# EAGLE design musicbox-interface (EAGLE 7.2.0)
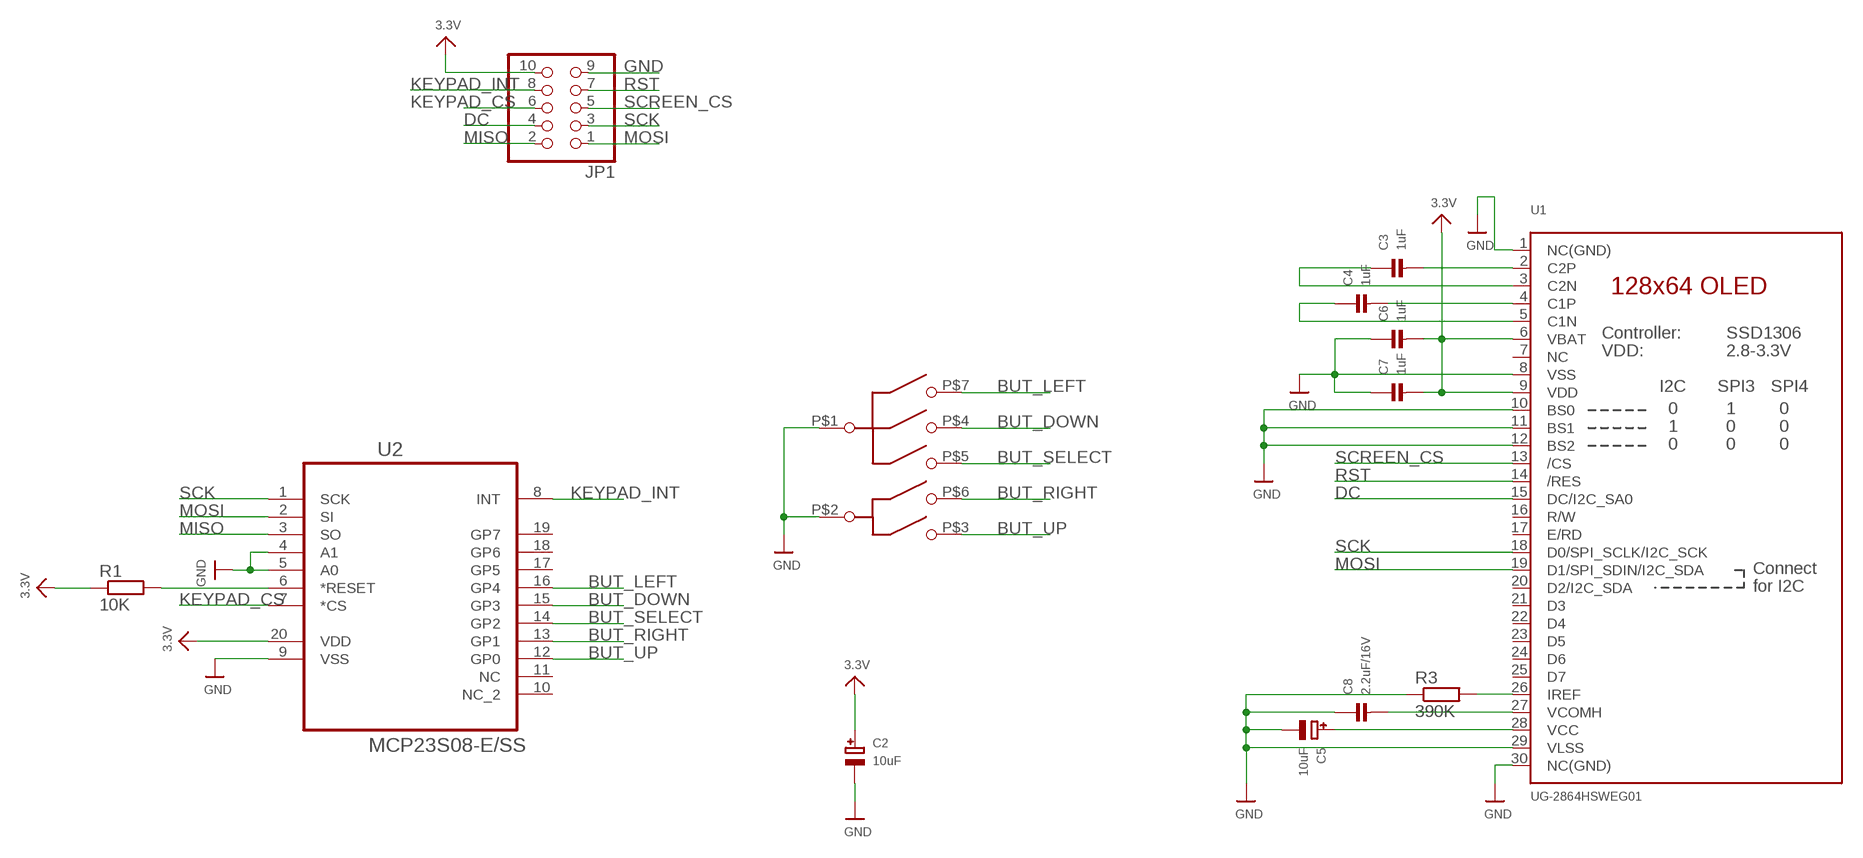
[diagram p0: schematic, sheet 1]

## Parts
C2  10uF  CAP_TANTALUMA/3216_REFLOW  [EIA3216-18/A-R]
C3  1uF  CAP_CERAMIC0603  [0603]
C4  1uF  CAP_CERAMIC0603  [0603]
C5  10uF  CAP_TANTALUMA/3216_REFLOW  [EIA3216-18/A-R]
C6  1uF  CAP_CERAMIC0603  [0603]
C7  1uF  CAP_CERAMIC0603  [0603]
C8  2.2uF/16V  CAP_CERAMIC0603  [0603]
JP1  HEADER-2X5  [2X05]
R1  10K  R-EU_R0603  [R0603]
R3  390K  R-EU_R0603  [R0603]
U1  UG-2864HSWEG01  DISP_OLED_UG-2864HSWEG010.96"  [UG-2864HSWEG01_0.96IN_WRAPAROUND]
U2  MCP23S08-E/SS  [SOP65P780X200-20N]
U$5  TPA  [SMT]

## Nets
3.3V: C2.+ C6.2 C7.2 JP1.10 R1.1 U1.6(VBAT) U1.9(VDD) U2.20(VDD)
BUT_DOWN: U2.15(GP3) U$5.P$4(DOWN)
BUT_LEFT: U2.16(GP4) U$5.P$7(LEFT)
BUT_RIGHT: U2.13(GP1) U$5.P$6(RIGHT)
BUT_SELECT: U2.14(GP2) U$5.P$5(SELECT)
BUT_UP: U2.12(GP0) U$5.P$3(UP)
DC: JP1.4 U1.15(DC/I2C_SA0)
GND: C2.- C5.- C6.1 C7.1 C8.1 JP1.9 R3.1 U1.1(NC(GND)) U1.8(VSS) U1.10(BS0) U1.11(BS1) U1.12(BS2) U1.29(VLSS) U1.30(NC(GND)) U2.4(A1) U2.5(A0) U2.9(VSS) U$5.P$1(COMMON_1) U$5.P$2(COMMON_2)
KEYPAD_CS: JP1.6 U2.7(*CS)
KEYPAD_INT: JP1.8 U2.8(INT)
MISO: JP1.2 U2.3(SO)
MOSI: JP1.1 U1.19(D1/SPI_SDIN/I2C_SDA) U2.2(SI)
N$1: C5.+ U1.28(VCC)
N$2: R1.2 U2.6(*RESET)
N$3: R3.2 U1.26(IREF)
N$4: C3.2 U1.2(C2P)
N$5: C3.1 U1.3(C2N)
N$6: C4.2 U1.4(C1P)
N$7: C4.1 U1.5(C1N)
N$12: C8.2 U1.27(VCOMH)
RST: JP1.7 U1.14(/RES)
SCK: JP1.3 U1.18(D0/SPI_SCLK/I2C_SCK) U2.1(SCK)
SCREEN_CS: JP1.5 U1.13(/CS)
Unconnected: U1.7(NC) U1.16(R/W) U1.17(E/RD) U1.20(D2/I2C_SDA) U1.21(D3) U1.22(D4) U1.23(D5) U1.24(D6) U1.25(D7) U2.10(NC_2) U2.11(NC) U2.17(GP5) U2.18(GP6) U2.19(GP7)

## Library data of the parts
C2 C5 = microbuilder:CAP_TANTALUM: Tantalum Capacitors Wave footprints have larger pads and are meant to be used for hand soldering. Reflow footprints are optimised for solder paste and a reflow oven. EIA3216-18/A-[R/W] - Size A / 3216-18 / 1206 footprint 4.7µF 25V 10% Tantalum Capacitor 10µF 16V 10% Tantalum Capacitor [Digikey: 495-2236-2-ND] EIA3528-21/B-[R/W] - Size B / 3528-21 47µF 10V 10% Tantalum Capactior [Digikey: 495-2216-1-ND] EIA6032-28/C-[R/W] - Size C / 6032-28 10µF 35V 20% Tantalum Capacitor [Digikey: 495-2285-1-ND] 100µF 16V 10% Tantalum Capactior [Digikey: 399-5214-1-ND]
C3 C4 C6-C8 = microbuilder:CAP_CERAMIC: Ceramic Capacitors 0402 - 0402 Surface Mount Capacitors 16pF 50V 5% [Digikey: 445-4899-2-ND] 18pF 50V 5% [Digikey: 490-1281-2-ND] 22pF 50V 5% [Digikey: 490-1283-2-ND] 68pF 50V 5% [Digikey: 490-1289-2-ND] 0.1uF 10V 10% [Digikey: 490-1318-2-ND] 1.0uF 6.3V 10% [Digikey: 490-1320-2-ND] 0603 - 0603 Surface Mount Capacitors 16 pF 50V 5% [Digikey: 445-5051-2-ND] 22 pF 50V [Digikey: PCC220ACVTR-ND] 33 pF 50V 5% [Digikey: 490-1415-1-ND] 56pF 50V 5% [Digikey: 490-1421-1-ND] 220pF 50V 5% [Digikey: 445-1285-1-ND] 680 pF 50V 2200 pF 50V 5% C0G [Digikey: 445-1297-1-ND] 5600 pF 100V 5% X7R [Digikey: 478-3711-1-ND] 0.1 µF 25V 10% [Digikey: PCC2277TR-ND] 0.22 µF 16V 10% X7R [Digikey: 445-1318-1-ND] 1.0 µF 25V 10% [Digikey: 445-5146-2-ND] 0603 - RF Specific 3pF 250V +/-0.1pF RF [Digikey: 712-1347-1-ND] 18 pF 250V 5% [Digikey: 478-3505-1-ND or 712-1322-1-ND] 56 pF 250V 5% C0G RF [Digikey: 490-4867-1-ND] 68 pF 250V RF [Digikey: 490-4868-1-ND] 0805 - 0805 Surface Mount Capacitors 220 pF 250V 2% RF Ceramic Capacitor [Digikey: 712-1398-1-ND] 1000 pF 50V 2% NP0 Ceramic Capacitor [Digikey: 478-3760-1-ND] 0.1 µF 25V 10% Ceramic Capacitor [Digikey: PCC1828TR-ND] 1.0 µF 16V 10% Ceramic Capacitor[Digikey: 490-1691-2-ND] 10.0 µF 10V 10% Ceramic Capacitor[Digikey: 709-1228-1-ND] 10.0 uF 16V 10% Ceramic Capacitor [Digikey: 478-5165-2-ND] 47 uF 6.3V 20% Ceramic Capacitor [Digikey: 587-1779-1-ND or 399-5506-1-ND] 1206 - 1206 Surface Mount Capacitors 47uF 10V 20% Ceramic Capacitor [Digikey: 490-5528-1-ND or 399-5508-1-ND or 445-6010-1-ND] 100uF 6.3V -20%, +80% Y5V Ceramic Capacitor (Digikey: 490-4512-1-ND, Mouser: 81-GRM31CF50J107ZE1L)
JP1 = header2x5:HEADER-2X5: PIN HEADER
R1 R3 = rcl:R-EU_: RESISTOR, European symbol
U1 = microbuilder:DISP_OLED_UG-2864HSWEG01: UG-2864HSWEG01 OLED display Both 1.3" and 0.96" models share the same FPC tab footprint, only the screen dimensions vary.
U2 = Microchip_By_element14_Batch_1:MCP23S08-E/SS: 8BIT I/O EXPANDER, SPI, SMD; MPN: MCP23S08-E/SS; OC_FARNELL: 1292236; OC_NEWARK: 08J8734; PACKAGE: 20SSOP; SUPPLIER: Microchip
U$5 = ck_tpa:TPA

## Board
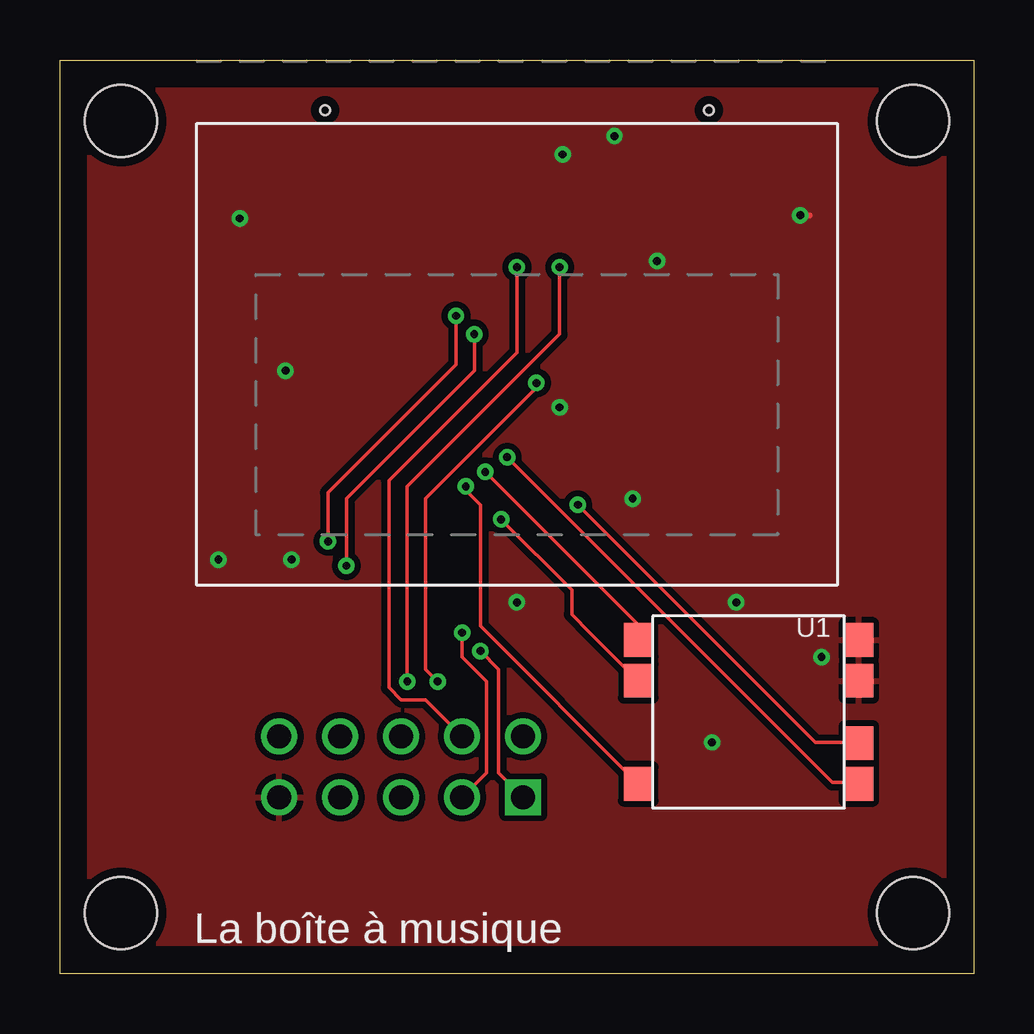
[diagram p1: board, top side]
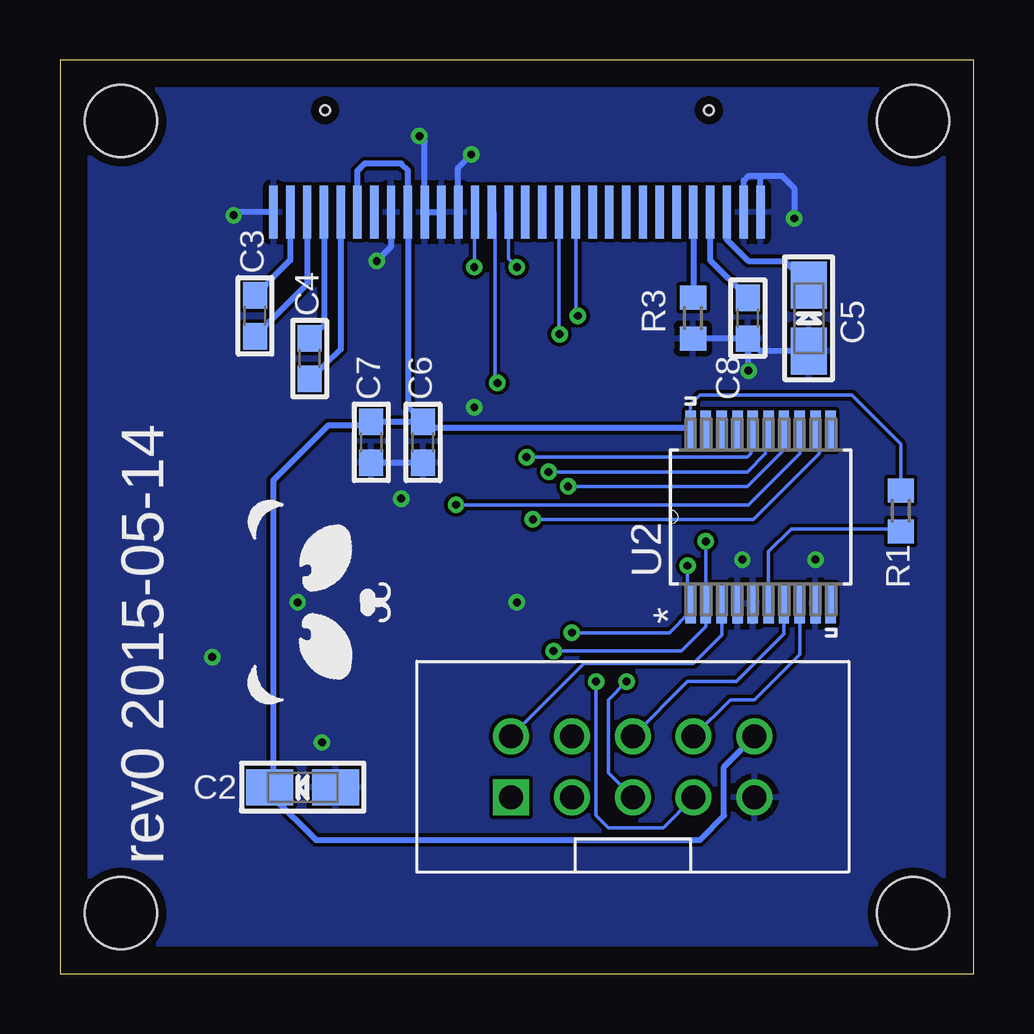
[diagram p2: board, bottom side, seen from below]

Size 38.1 x 38.1 mm. Coordinates in mm from the lower left corner, seen from the top.
Outline: 0,0 0,38.1 38.1,38.1 38.1,0 0,0
Copper layers (1*16): Top 0.0356mm / dielectric 1.5011mm / Bottom 0.0356mm
Design rules "LaenPCBOrder": minimum track width 6mil, minimum drill 13mil, track to track 6mil, track to pad 6mil, pad to pad 6mil, via to via 6mil, smd to smd 6mil, copper to edge 15mil, drill to drill 6mil, minimum pad ring 7mil, minimum via ring 7mil, stop-mask expansion 3mil, vias tented up to drill 0mil, thermal gap 10mil
Holes 3 mm at 2.54,35.56 35.56,35.56 2.54,2.54 35.56,2.54

### Footprints (pad centres in the part's own frame; a part is rotated, then mirrored left to right if it is on the bottom)
EIA3216-18/A-R = smd 1.95 x 1.5: + 1.375,0; - -1.375,0
0603 = smd 1.1 x 1: 1 -0.85,0; 2 0.85,0
2X05 = drill 1 square: 1 -5.08,-1.27 | drill 1: 2 -5.08,1.27; 3 -2.54,-1.27; 4 -2.54,1.27; 5 0,-1.27; 6 0,1.27; 7 2.54,-1.27; 8 2.54,1.27; 9 5.08,-1.27; 10 5.08,1.27
R0603 = smd 1 x 1.1: 1 -0.85,0; 2 0.85,0
UG-2864HSWEG01_0.96IN_WRAPAROUND = smd 0.35 x 2.2 bottom: 1 -10.15,-1.2; 2 -9.45,-1.2; 3 -8.75,-1.2; 4 -8.05,-1.2; 5 -7.35,-1.2; 6 -6.65,-1.2; 7 -5.95,-1.2; 8 -5.25,-1.2; 9 -4.55,-1.2; 10 -3.85,-1.2; 11 -3.15,-1.2; 12 -2.45,-1.2; 13 -1.75,-1.2; 14 -1.05,-1.2; 15 -0.35,-1.2; 16 0.35,-1.2; 17 1.05,-1.2; 18 1.75,-1.2; 19 2.45,-1.2; 20 3.15,-1.2; 21 3.85,-1.2; 22 4.55,-1.2; 23 5.25,-1.2; 24 5.95,-1.2; 25 6.65,-1.2; 26 7.35,-1.2; 27 8.05,-1.2; 28 8.75,-1.2; 29 9.45,-1.2; 30 10.15,-1.2 | hole 0.4: -8,-5.45; 8,-5.45
SOP65P780X200-20N = smd 1.676 x 0.432: 1 -3.607,2.921; 2 -3.607,2.286; 3 -3.607,1.626; 4 -3.607,0.965; 5 -3.607,0.33; 6 -3.607,-0.33; 7 -3.607,-0.965; 8 -3.607,-1.626; 9 -3.607,-2.286; 10 -3.607,-2.921; 11 3.607,-2.921; 12 3.607,-2.286; 13 3.607,-1.626; 14 3.607,-0.965; 15 3.607,-0.33; 16 3.607,0.33; 17 3.607,0.965; 18 3.607,1.626; 19 3.607,2.286; 20 3.607,2.921
SMT = smd 1.2 x 1.4: P$1 -4.6,-3; P$2 -4.6,-1.3; P$3 4.6,-1.3; P$4 4.6,-3; P$5 4.6,3; P$6 -4.6,1.3; P$7 -4.6,3

### Placement (x,y rotation side)
C2  27.98,7.78 180 bottom
C3  29.97,27.43 90 bottom
C4  27.69,25.65 90 bottom
C5  6.88,27.34 90 bottom
C6  22.96,22.16 90 bottom
C7  25.12,22.16 90 bottom
C8  9.42,27.34 90 bottom
JP1  14.22,8.64 0 bottom
R1  3.05,19.3 270 bottom
R3  11.71,27.34 90 bottom
U1  19.05,30.56 180 top
U2  8.89,19.05 90 bottom
U$5  28.7,10.92 180 top
U$8  [PANDA]  26.42,15.49 90 bottom

### Tracks (layer width: path | path; a pad name or v marks a point on that pad's centre or on a via)
3.3V
  Bottom 0.152: 11.89,22.76 U2.20 11.81,23.75 11.43,24.13 5.08,24.13 3.05,22.1 R1.1
  Bottom 0.254: U1.6 25.7,33.48 25.4,33.78 23.88,33.78 23.6,33.5 U1.9 23.6,23.65 C6.2 | C6.2 C7.2 | 24.78,22.95 C7.2 | 22.61,23.37 C6.2 | 11.89,22.76 22.71,22.76 C6.2 | 29.21,7.87 29.21,20.57 26.92,22.86 25.28,22.86 C7.2 | C2.+ 29.31,7.78 29.21,7.87 | 29.21,7.87 29.21,7.37 27.43,5.59 11.43,5.59 10.41,6.6 10.41,8.64 JP1.10
BUT_DOWN  (via drill 0.33)
  Top 0.152: v17.73,20.93 24.59,14.07 U$5.P$4
  Bottom 0.152: v17.73,20.93 9.45,20.93 8.69,21.69 8.69,22.61 U2.15
BUT_LEFT  (via drill 0.33)
  Top 0.152: v18.64,21.54 32.21,7.98 33.22,7.98 U$5.P$7
  Bottom 0.152: v18.64,21.54 9.45,21.54 9.3,21.69 9.3,22.61 U2.16
BUT_RIGHT  (via drill 0.33)
  Top 0.152: v21.59,19.56 31.5,9.65 33.27,9.65 U$5.P$6
  Bottom 0.152: U2.13 7.26,21.69 9.4,19.56 v21.59,19.56
BUT_SELECT  (via drill 0.33)
  Top 0.152: 24.08,7.98 U$5.P$5 17.53,14.5 17.53,19.56 16.92,20.17 v16.92,20.32
  Bottom 0.152: v16.92,20.32 9.45,20.32 7.92,21.84 U2.14
BUT_UP  (via drill 0.33)
  Top 0.152: 24.08,12.24 U$5.P$3 | v18.39,18.95 21.34,16 21.34,14.99 22.1,14.22 U$5.P$3 | 24.07,12.19 U$5.P$3
  Bottom 0.152: v18.39,18.95 9.2,18.95 6.45,21.69 6.45,22.86 U2.12
DC  (via drill 0.33)
  Top 0.152: v19.05,29.46 19.05,25.91 13.72,20.57 13.72,11.94 14.22,11.43 15.24,11.43 JP1.4
  Bottom 0.152: U1.15 19.4,29.81 v19.05,29.46
GND  (via drill 0.33)
  Top 0.254: v30.86,31.62 31.24,31.62 | v20.95,34.16 20.83,34.16 | v24.89,29.72 24.89,29.59 | v7.49,31.5 7.49,31.24
  Bottom 0.254: C7.1 C6.1 | U1.1 30.73,31.76 v30.86,31.62 | v23.11,34.93 22.9,34.71 U1.10 U1.11 | U1.12 21.5,33.62 v20.95,34.16 | U1.8 24.3,30.31 v24.89,29.72 | U1.29 9.6,33.07 9.4,33.27 8.89,33.27 | 8.89,33.27 8,33.27 7.49,32.77 v7.49,31.5 | U1.30 8.9,33.27 8.89,33.27 | C5.- 8.9,25.96 C8.1 | C8.1 R3.1 | C8.1 9.42,25.12 v9.4,25.15
  other vias: 23.88,19.81 31.75,13.21 27.18,9.65 28.19,15.49 19.05,15.49 6.6,17.27 9.65,17.27 20.83,23.62
  pour Top (isolate 0.254): 1.27,1.27 1.27,36.83 36.83,36.83 36.83,1.27
  pour Bottom: 36.83,1.27 1.27,1.27 1.27,36.83 36.83,36.83
KEYPAD_CS
  Bottom 0.152: U2.7 7.92,14.17 9.91,12.19 11.94,12.19 JP1.6
KEYPAD_INT
  Bottom 0.152: U2.8 7.26,13.31 9.14,11.43 10.16,11.43 JP1.8
MISO
  Bottom 0.152: U2.3 10.52,14.12 11.68,12.95 16.26,12.95 JP1.2
MOSI  (via drill 0.33)
  Top 0.152: v16.51,27.43 16.51,25.4 11.18,20.07 v11.18,18.03 | v17.53,13.46 18.29,12.7 18.29,8.38 JP1.1
  Bottom 0.152: U1.19 16.6,27.52 v16.51,27.43 | v11.18,18.03 U2.2 11.18,14.48 12.19,13.46 v17.53,13.46
N$1
  Bottom 0.254: U1.28 10.3,30.62 9.4,29.72 7.89,29.72 C5.+
N$2
  Bottom 0.152: U2.6 8.56,17.6 7.62,18.54 3.14,18.54 R1.2
N$3
  Bottom 0.254: U1.26 11.7,28.2 R3.2
N$4
  Bottom 0.254: U1.2 28.5,29.76 C3.2
N$5
  Bottom 0.254: U1.3 27.8,28.76 C3.1
N$6
  Bottom 0.254: U1.4 27.1,27.05 C4.2
N$7
  Bottom 0.254: U1.5 26.4,26.05 C4.1
N$12
  Bottom 0.254: U1.27 11,29.76 C8.2
RST  (via drill 0.33)
  Top 0.152: v19.86,24.64 19.86,24.44 15.24,19.81 15.24,12.7 v15.75,12.19
  Bottom 0.152: v19.86,24.64 19.96,24.74 19.96,31.75 U1.14 | v15.75,12.19 15.75,6.6 15.24,6.1 12.95,6.1 JP1.7
SCK  (via drill 0.33)
  Top 0.152: v17.27,26.67 17.27,25.15 11.94,19.81 v11.94,17.02 | v16.76,14.22 16.76,13.21 17.78,12.19 17.78,8.38 JP1.3
  Bottom 0.152: U1.18 17.3,26.7 v17.27,26.67 | v11.94,17.02 11.94,15.57 U2.1 11.81,15.11 12.7,14.22 v16.76,14.22
SCREEN_CS  (via drill 0.33)
  Top 0.152: v14.48,12.19 14.48,20.32 20.83,26.67 v20.83,29.46
  Bottom 0.152: v20.83,29.46 20.83,31.73 U1.13 | v14.48,12.19 15.24,11.43 15.24,8.38 JP1.5

### Text on the board
bPlace: rev0 2015-05-14
tNames: La boîte à musique